# Altium project MB1419.PrjPcb (part 2 of 2)
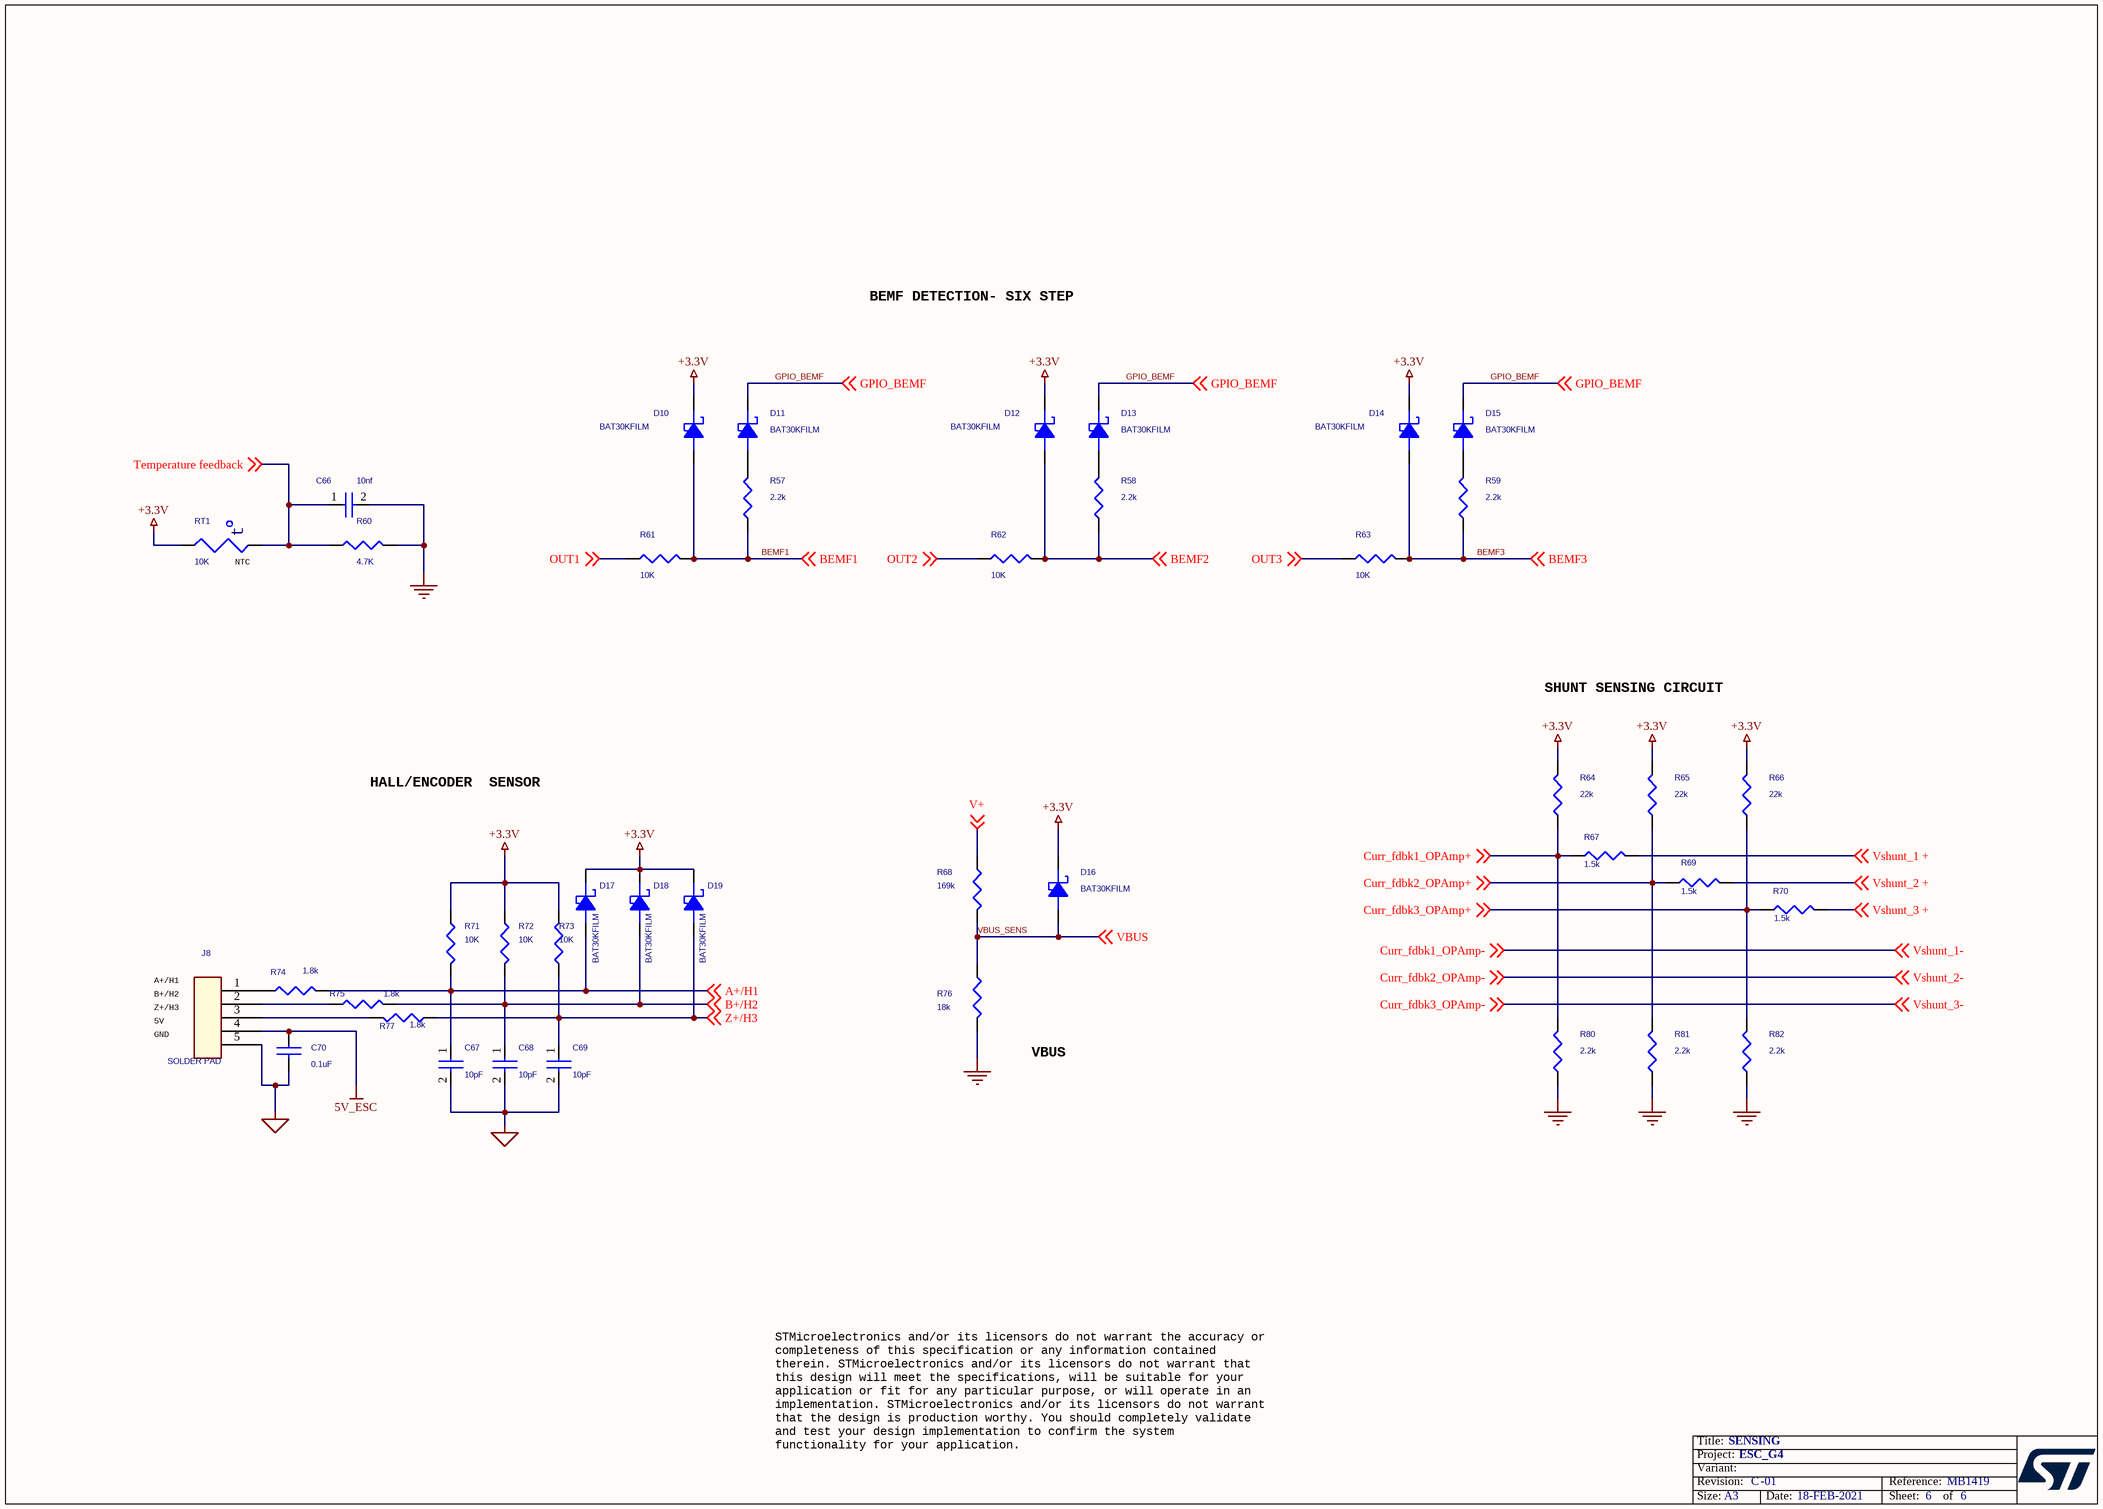
[diagram p7: SENSING.SchDoc]

## Nets that join several sheets
5V_ESC: CAN (D1.C), DAUGHTERBOARD (C9.1 U5.6 U5.7), POWER STAGE (6 pins), SENSING (C70.1 J8.4)
+3.3V: CAN (C1.1 C2.1 U1.2 U2.3), MCU (11 pins), POWER STAGE (C64.1 R49.2 U14.1), SENSING (14 pins)
+5V: DAUGHTERBOARD (C6.1 U3.2 U3.4), MCU (J3.1)
+10V: DAUGHTERBOARD (C5.1 U3.3), POWER STAGE (16 pins)
GND: CAN (6 pins), DAUGHTERBOARD (43 pins), MCU (15 pins), POWER STAGE (55 pins), SENSING (11 pins)
A+/H1: MCU (U8.44), SENSING (C67.1 D17.A R71.2 R74.2)
B+/H2: MCU (U8.45), SENSING (C68.1 D18.A R72.2 R75.2)
BEMF1: MCU (U8.12), SENSING (D10.A R57.1 R61.2)
BEMF2: MCU (U8.16), SENSING (D12.A R58.1 R62.2)
BEMF3: MCU (U8.24), SENSING (D14.A R59.1 R63.2)
BUTTON: DAUGHTERBOARD (C8.1 R10.2 SW1.3 SW1.4), MCU (U8.39)
CAN_RX: CAN (U2.4), MCU (U8.33)
CAN_SHDN: CAN (U2.5), MCU (TP2.1 U8.40)
CAN_TERM: CAN (U1.3), MCU (R26.2)
CAN_TX: CAN (U2.1), MCU (U8.47)
Curr_fdbk1_OPAmp+: MCU (U8.9), SENSING (R64.1 R67.1 R80.2)
Curr_fdbk1_OPAmp-: MCU (U8.11), POWER STAGE (JP1.1)
Curr_fdbk2_OPAmp+: MCU (U8.15), SENSING (R65.1 R69.1 R81.2)
Curr_fdbk2_OPAmp-: MCU (U8.13), POWER STAGE (JP2.1)
Curr_fdbk3_OPAmp+: MCU (U8.17), SENSING (R66.1 R70.1 R82.2)
Curr_fdbk3_OPAmp-: MCU (U8.19), POWER STAGE (JP3.1)
GPIO_BEMF: MCU (U8.43), SENSING (D11.C D13.C D15.C)
OUT1: POWER STAGE (12 pins), SENSING (R61.1)
OUT2: POWER STAGE (12 pins), SENSING (R62.1)
OUT3: POWER STAGE (12 pins), SENSING (R63.1)
PA0 - BUSV: MCU (C23.1 U8.8), SENSING (D16.A R68.2 R76.1)
PC13-UL: MCU (U8.2), POWER STAGE (C47.1 U10.1)
SPEED: DAUGHTERBOARD (R2.2), MCU (C22.1 U8.25)
T_JTCK: DAUGHTERBOARD (U6.15 U6.26), MCU (J4.2 U8.37)
T_JTMS: DAUGHTERBOARD (R20.2 U6.27), MCU (J4.1 U8.36)
T_NRST: DAUGHTERBOARD (U6.18), MCU (C21.1 U8.7)
Temperature feedback: MCU (U8.27), SENSING (C66.1 R60.1 RT1.2)
UH: MCU (U8.30), POWER STAGE (C48.1 U10.2)
USART2_RX: DAUGHTERBOARD (R23.1), MCU (J3.3 U8.42)
USART2_RX_ST_LINK: DAUGHTERBOARD (R24.1), MCU (J3.2 U8.41)
V+: POWER STAGE (33 pins), SENSING (R68.1)
VH: MCU (U8.31), POWER STAGE (C54.1 U11.2)
VL: MCU (U8.34), POWER STAGE (C53.1 U11.1)
Vshunt_1 +: POWER STAGE (5 pins), SENSING (R67.2)
Vshunt_2 +: POWER STAGE (5 pins), SENSING (R69.2)
Vshunt_3 +: POWER STAGE (5 pins), SENSING (R70.2)
WH: MCU (U8.32), POWER STAGE (C61.1 U13.2)
WL: MCU (U8.28), POWER STAGE (C60.1 U13.1)
Z+/H3: MCU (U8.46), SENSING (C69.1 D19.A R73.1 R77.1)

## Assembly variants
G431CBU6: not fitted C12 J1 J2 J3 J4 J5 J6 J7 J8 JP1 JP2 JP3 R17 TP1 TP2 TP3